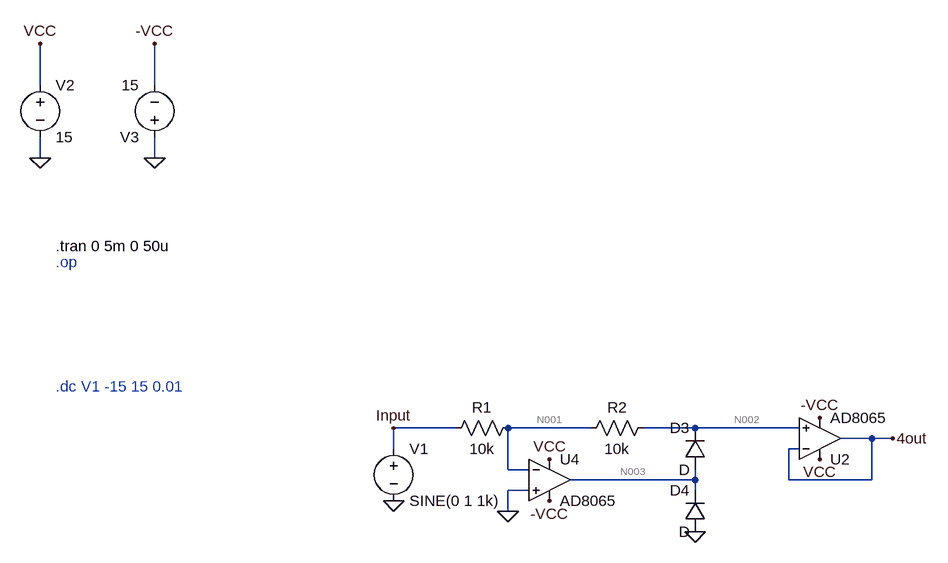
[diagram p0: schematic etaj4.asc]
etaj4.asc, the LTspice schematic file:
Version 4
SHEET 1 3368 792
WIRE 16 -528 16 -592
WIRE 192 -528 192 -592
WIRE 16 -416 16 -448
WIRE 192 -416 192 -448
WIRE 656 0 560 0
WIRE 864 0 736 0
WIRE 1024 0 944 0
WIRE 1184 0 1024 0
WIRE 1296 16 1248 16
WIRE 1328 16 1296 16
WIRE 560 32 560 0
WIRE 1184 32 1168 32
WIRE 736 64 736 0
WIRE 768 64 736 64
WIRE 1024 80 1024 64
WIRE 1024 80 832 80
WIRE 1168 80 1168 32
WIRE 1296 80 1296 16
WIRE 1296 80 1168 80
WIRE 768 96 736 96
WIRE 1024 96 1024 80
WIRE 736 128 736 96
FLAG 736 128 0
FLAG 1024 160 0
FLAG 800 48 VCC
FLAG 1216 -16 -VCC
FLAG 800 112 -VCC
FLAG 1216 48 VCC
FLAG 560 0 Input
FLAG 560 112 0
FLAG 1328 16 4out
FLAG 16 -416 0
FLAG 16 -592 VCC
FLAG 192 -416 0
FLAG 192 -592 -VCC
SYMBOL res 752 -16 R90
WINDOW 0 0 56 VBottom 2
WINDOW 3 32 56 VTop 2
SYMATTR InstName R1
SYMATTR Value 10k
SYMBOL res 960 -16 R90
WINDOW 0 0 56 VBottom 2
WINDOW 3 32 56 VTop 2
SYMATTR InstName R2
SYMATTR Value 10k
SYMBOL diode 1040 64 R180
WINDOW 0 24 64 Left 2
WINDOW 3 24 0 Left 2
SYMATTR InstName D3
SYMBOL diode 1040 160 R180
WINDOW 0 24 64 Left 2
WINDOW 3 24 0 Left 2
SYMATTR InstName D4
SYMBOL voltage 560 16 R0
WINDOW 123 0 0 Left 0
WINDOW 39 0 0 Left 0
SYMATTR InstName V1
SYMATTR Value SINE(0 1 1k)
SYMBOL OpAmps\\AD8065 800 16 R0
SYMATTR InstName U4
SYMBOL voltage 16 -544 R0
WINDOW 123 0 0 Left 2
WINDOW 39 0 0 Left 2
SYMATTR InstName V2
SYMATTR Value 15
SYMBOL voltage 192 -432 R180
WINDOW 123 0 0 Left 2
WINDOW 39 0 0 Left 2
SYMATTR InstName V3
SYMATTR Value 15
SYMBOL OpAmps\\AD8065 1216 80 M180
SYMATTR InstName U2
TEXT 40 -280 Left 2 !.tran 0 5m 0 50u
TEXT 40 -256 Left 2 ;.op
TEXT 40 -64 Left 2 ;.dc V1 -15 15 0.01

The netlist it stands for:
* etaj4.asc
R1 N001 Input 10k
R2 N002 N001 10k
D3 N003 N002 D
D4 0 N003 D
V1 Input 0 SINE(0 1 1k)
XU4 0 N001 VCC -VCC N003 AD8065  ; pins In+ In- V+ V- OUT
V2 VCC 0 15
V3 0 -VCC 15
XU2 N002 4out VCC -VCC 4out AD8065  ; pins In+ In- V+ V- OUT
.model D D
.lib standard.dio
.tran 0 5m 0 50u
* .op
* .dc V1 -15 15 0.01
.backanno
.end

* Results of the author's LTspice run, read from the files saved beside the schematic
* Operating Point, zero values left out:
*   V(n001) = -367.1 nV
*   V(n002) = -344.5 nV
*   V(n003) = -771.7 mV
*   V(vcc) = 15 V
*   V(-vcc) = -15 V
*   V(4out) = -400.3 µV
*   I(D4) = 90.6 mA
*   I(R1) = -36.71 pA
*   I(R2) = 2.258 pA
*   I(V1) = -36.71 pA
*   I(V2) = -12.8 mA
*   I(V3) = -103.4 mA
*   Ix(u4:100) = -43 pA
*   Ix(u4:101) = 38.96 pA
*   Ix(u4:102) = 6.402 mA
*   Ix(u4:103) = -97 mA
*   Ix(u4:104) = 90.6 mA
*   Ix(u2:100) = -3.04 pA
*   Ix(u2:101) = -1.04 pA
*   Ix(u2:102) = 6.402 mA
*   Ix(u2:103) = -6.402 mA
*   Ix(u2:104) = 1.04 pA
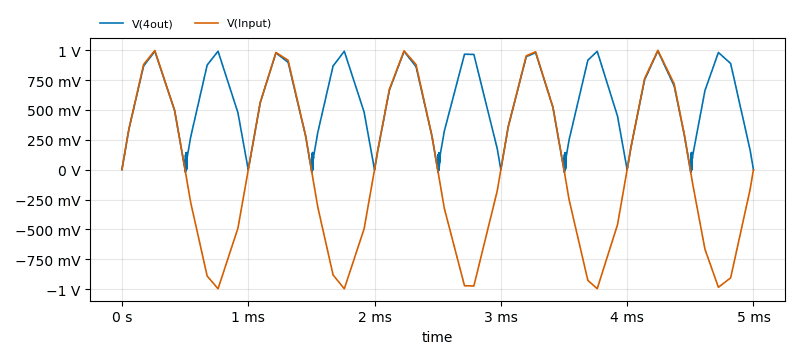
[diagram p1: Transient Analysis of etaj4.asc, plotted from the saved traces]
* Transient Analysis, 1 run:
*   V(4out): min -22.35 mV, max 996.2 mV, average 625.9 mV, rms 698.3 mV, last 92.97 µV
*   V(Input): min -999.5 mV, max 1 V, average 230.5 µV, rms 706.8 mV, last 0 V